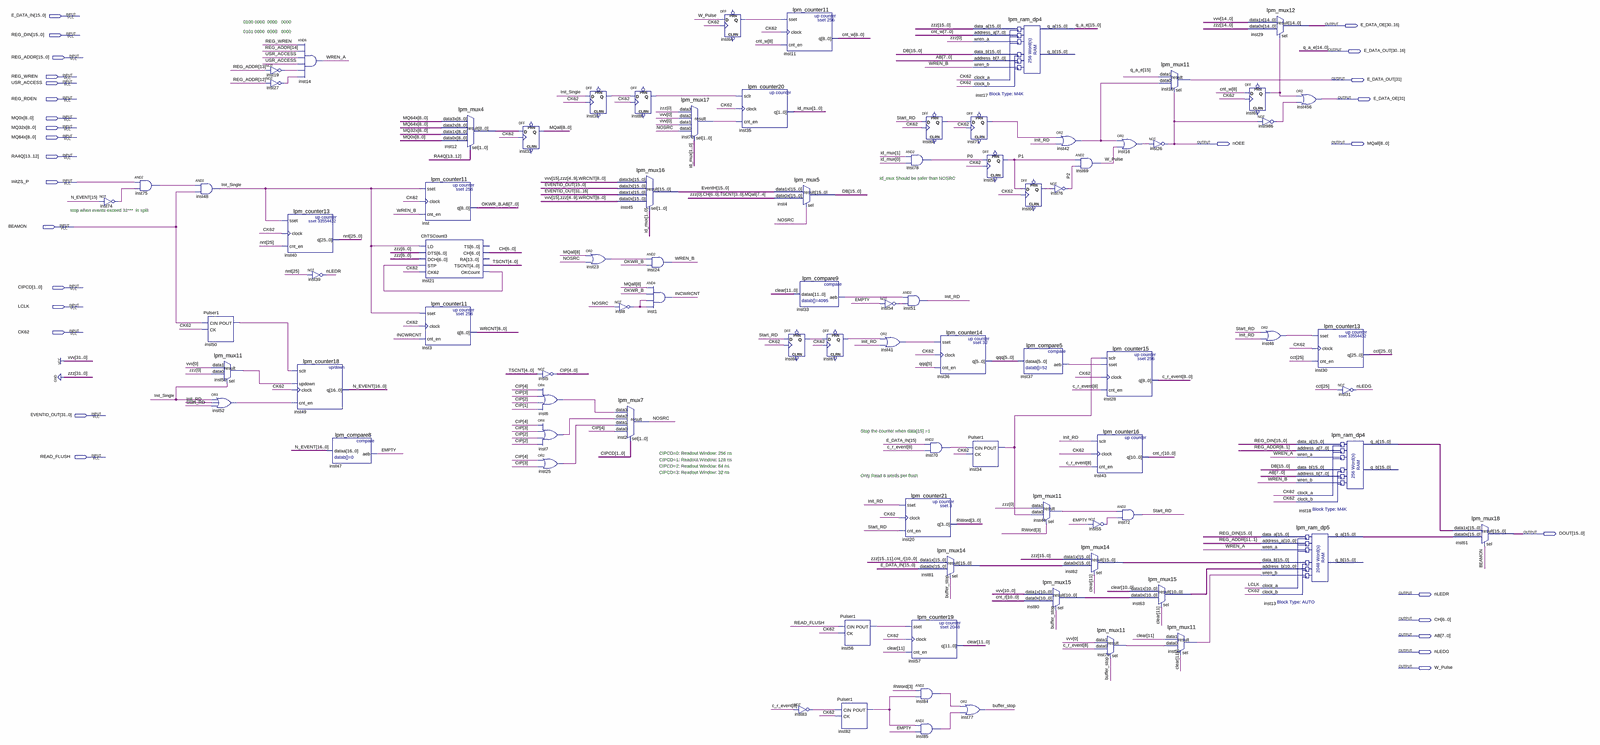
[diagram p0: schematic sheet, whole]
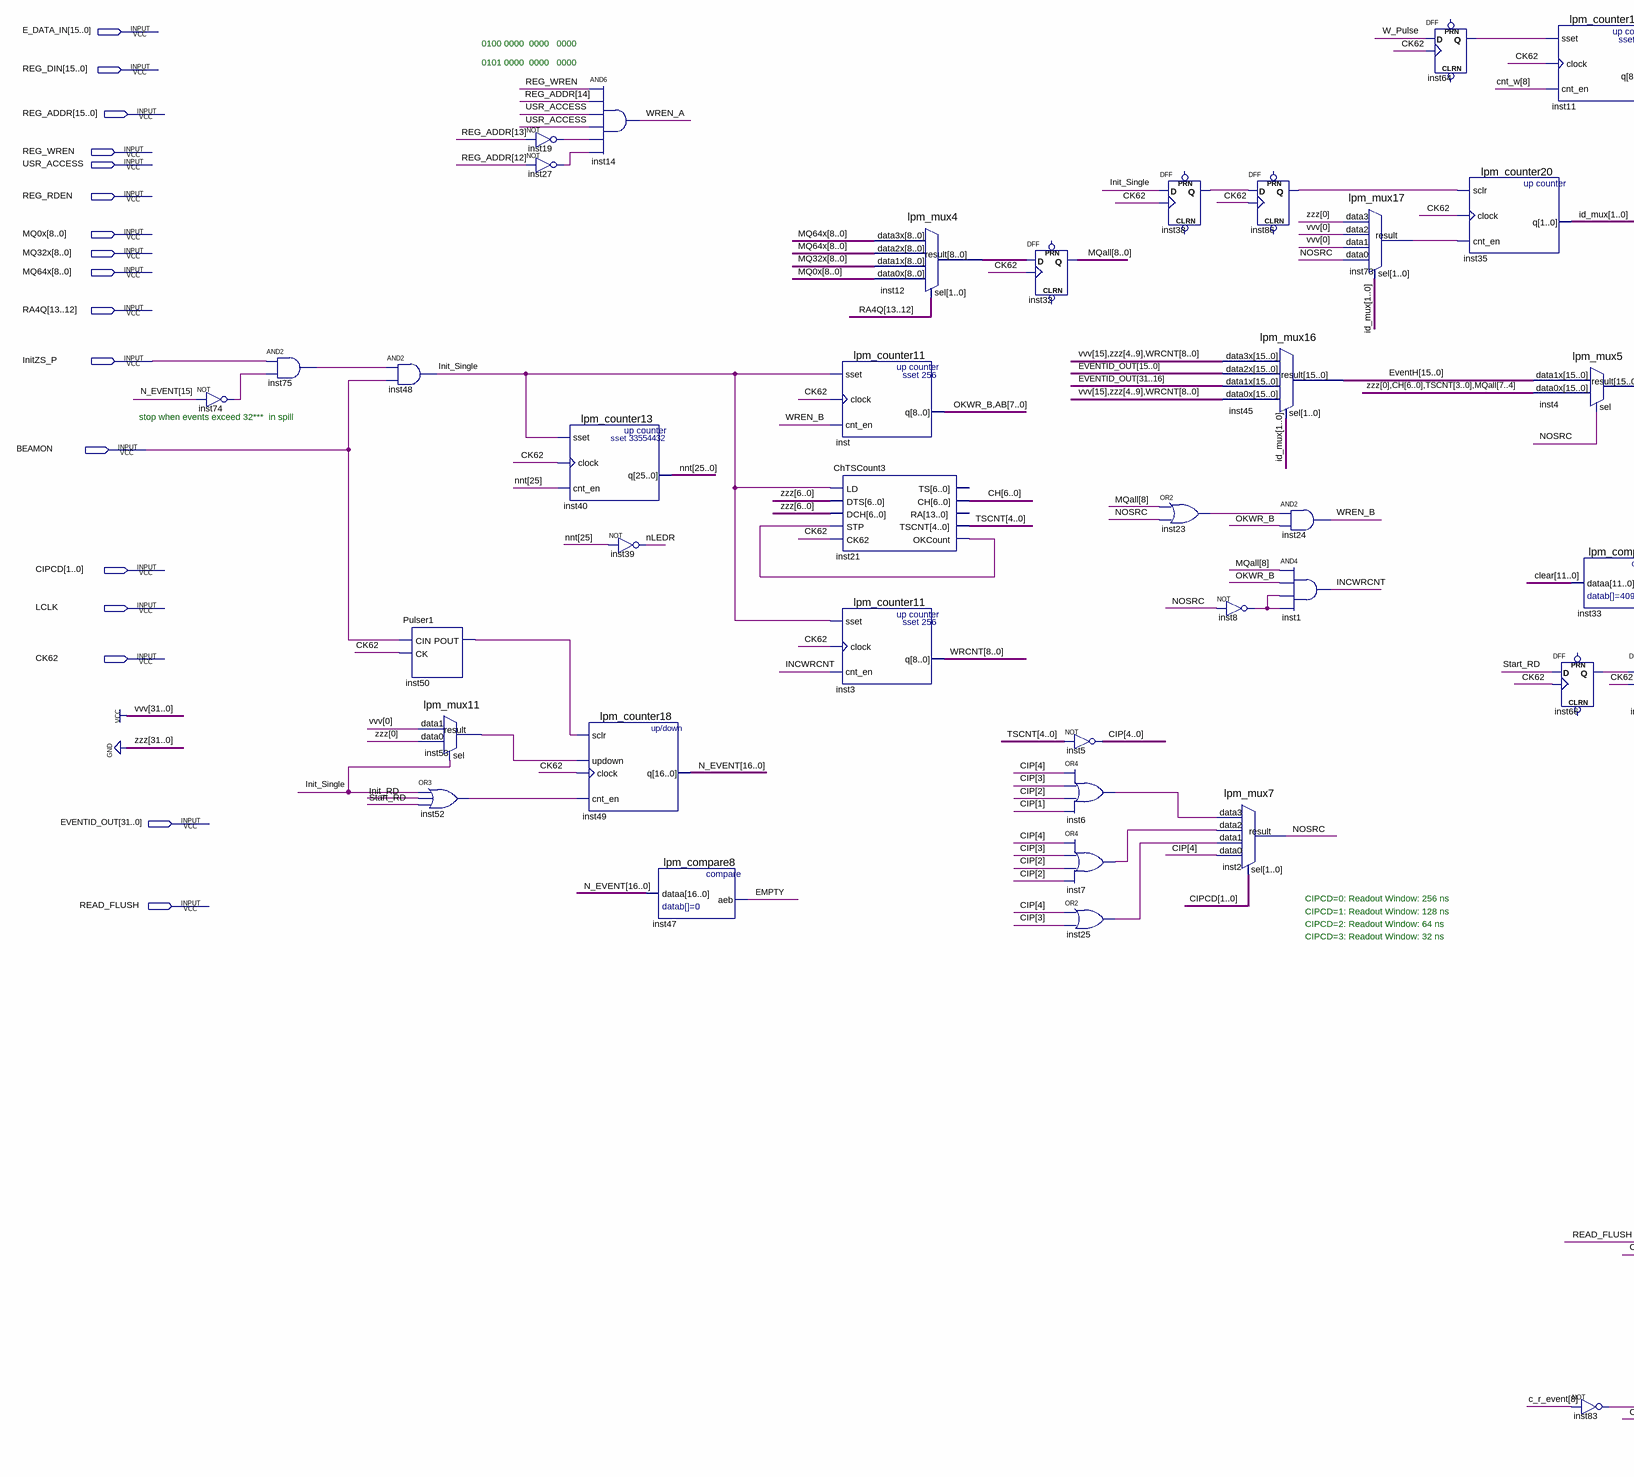
[diagram p1: schematic sheet, left part]
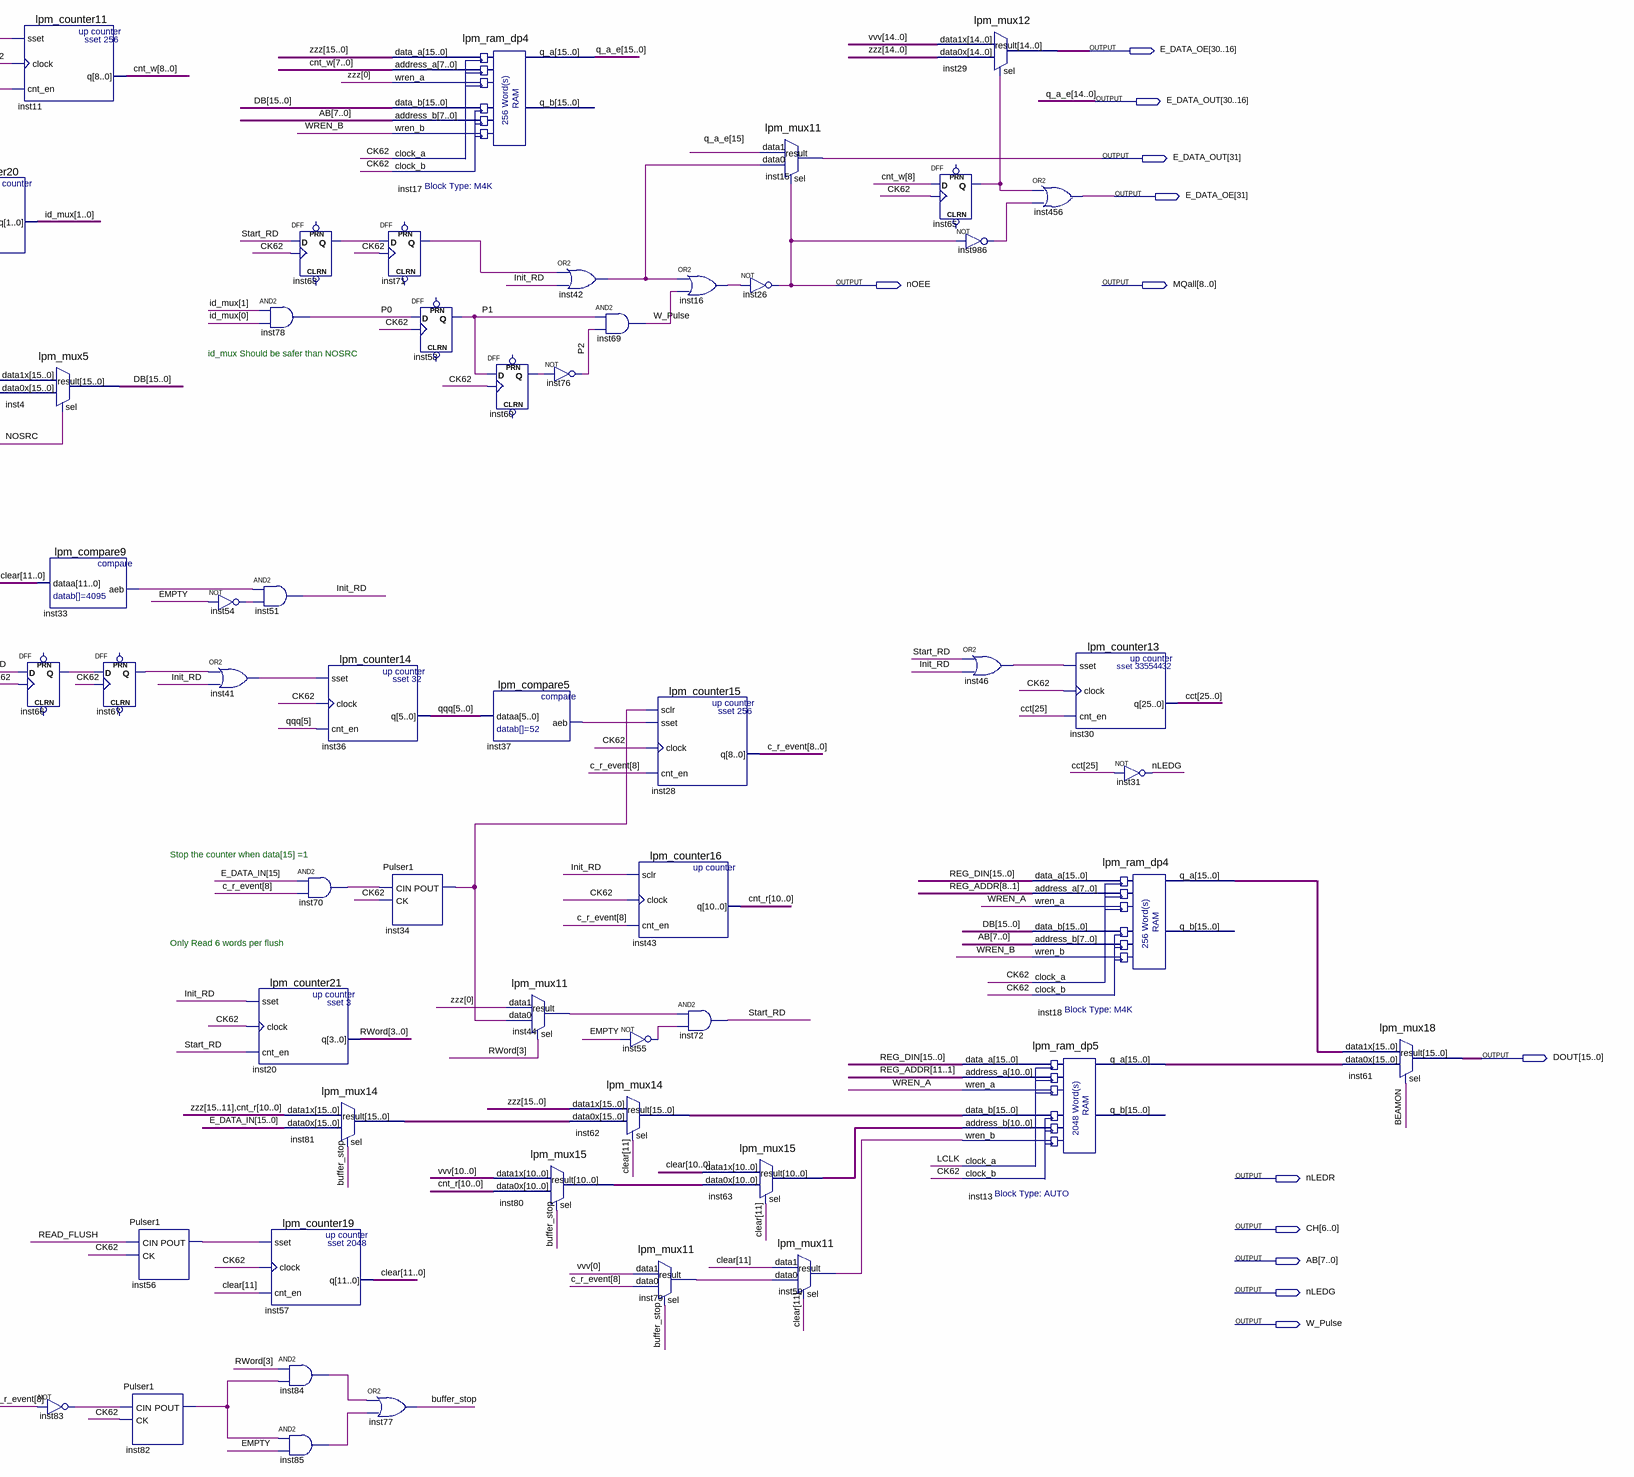
[diagram p2: schematic sheet, right part]
// Quartus schematic ZeroSuppr3.bdf as structural Verilog: 86 symbols, 29 pins
module ZeroSuppr3 (
  input  [15:0] E_DATA_IN,
  input  [15:0] REG_DIN,
  input  [15:0] REG_ADDR,
  input  REG_WREN,
  input  USR_ACCESS,
  input  REG_RDEN,
  input  [8:0] MQ0x,
  input  [8:0] MQ32x,
  input  [8:0] MQ64x,
  input  [13:12] RA4Q,
  input  InitZS_P,
  input  BEAMON,
  input  [1:0] CIPCD,
  input  LCLK,
  input  CK62,
  input  [31:0] EVENTID_OUT,
  input  READ_FLUSH,
  output [31:16] E_DATA_OE,
  output [31:16] E_DATA_OUT,
  output nOEE,
  output [8:0] MQall,
  output [15:0] DOUT,
  output nLEDR,
  output [6:0] CH,
  output [7:0] AB,
  output nLEDG,
  output W_Pulse
);

  wire buffer_stop, EMPTY, INCWRCNT, Init_RD, Init_Single, inst6_out, inst7_out, inst8_out, inst16_out,
       inst19_out, inst21_okcount, inst23_out, inst25_out, inst27_out, inst33_aeb, inst34_pout, inst37_aeb,
       inst38_q, inst41_out, inst42_out, inst44_result, inst46_out, inst50_pout, inst52_out, inst53_result,
       inst54_out, inst55_out, inst56_pout, inst59_result, inst60_q, inst64_q, inst65_q, inst66_q, inst67_q,
       inst68_q, inst70_out, inst71_q, inst73_result, inst74_out, inst75_out, inst79_result, inst82_pout,
       inst83_out, inst84_out, inst85_out, inst86_q, inst986_out, NOSRC, OKWR_B, P0, P1, P2, Start_RD,
       WREN_A, WREN_B;
  wire [1:0] id_mux;
  wire [3:0] RWord;
  wire [4:0] CIP, TSCNT;
  wire [5:0] qqq;
  wire [8:0] c_r_event, cnt_w, inst12_result, WRCNT;
  wire [10:0] cnt_r, inst63_result, inst80_result;
  wire [11:0] clear;
  wire [15:0] DB, EventH, inst13_q_a, inst18_q_a, inst62_result, inst81_result;
  wire [15:15] q_a_e;
  wire [16:0] N_EVENT;
  wire [25:0] cct, nnt;

  not inst74 (inst74_out, N_EVENT[15]);
  and inst75 (inst75_out, InitZS_P, inst74_out);
  and inst48 (Init_Single, inst75_out, BEAMON);
  Pulser1 inst50 (.CIN(BEAMON), .CK(CK62), .POUT(inst50_pout));
  lpm_mux11 inst53 (.data1(1'b1), .data0(1'b0), .sel(Init_Single), .result(inst53_result));
  or inst52 (inst52_out, Init_Single, Init_RD, Start_RD);
  not inst19 (inst19_out, REG_ADDR[13]);
  not inst27 (inst27_out, REG_ADDR[12]);
  lpm_counter13 inst40 (.sset(Init_Single), .clock(CK62), .cnt_en(nnt[25]), .q(nnt));
  and inst14 (WREN_A, REG_WREN, REG_ADDR[14], USR_ACCESS, USR_ACCESS, inst19_out, inst27_out);
  not inst39 (nLEDR, nnt[25]);
  lpm_counter18 inst49 (.sclr(inst50_pout), .updown(inst53_result), .clock(CK62), .cnt_en(inst52_out), .q(N_EVENT));
  lpm_compare8 inst47 (.dataa(N_EVENT), .aeb(EMPTY));
  lpm_counter11 inst (.sset(Init_Single), .clock(CK62), .cnt_en(WREN_B), .q({OKWR_B, AB}));
  ChTSCount3 inst21 (
    .LD(Init_Single), .DTS({7{1'b0}}), .DCH({7{1'b0}}), .STP(inst21_okcount), .CK62(CK62), .CH(CH),
    .TSCNT(TSCNT), .OKCount(inst21_okcount));  // open: TS, RA
  lpm_counter11 inst3 (.sset(Init_Single), .clock(CK62), .cnt_en(INCWRCNT), .q(WRCNT));
  lpm_mux4 inst12 (.data3x(MQ64x), .data2x(MQ64x), .data1x(MQ32x), .data0x(MQ0x), .sel(RA4Q), .result(inst12_result));
  DFF inst32[8:0] (.CLK(CK62), .D(inst12_result), .Q(MQall));  // open: CLRN, PRN
  assign CIP = ~TSCNT;  // NOT inst5, 5 bits wide
  or inst6 (inst6_out, CIP[4], CIP[3], CIP[2], CIP[1]);
  or inst7 (inst7_out, CIP[4], CIP[3], CIP[2], CIP[2]);
  or inst25 (inst25_out, CIP[4], CIP[3]);
  DFF inst38 (.CLK(CK62), .D(Init_Single), .Q(inst38_q));  // open: CLRN, PRN
  or inst23 (inst23_out, MQall[8], NOSRC);
  lpm_mux16 inst45 (
    .data3x({7'b1000000, WRCNT}), .data2x(EVENTID_OUT[15:0]), .data1x(EVENTID_OUT[31:16]),
    .data0x({7'b1000000, WRCNT}), .sel(id_mux), .result(EventH));
  not inst8 (inst8_out, NOSRC);
  lpm_mux7 inst2 (
    .data3(inst6_out), .data2(inst7_out), .data1(inst25_out), .data0(CIP[4]), .sel(CIPCD), .result(NOSRC));
  DFF inst86 (.CLK(CK62), .D(inst38_q), .Q(inst86_q));  // open: CLRN, PRN
  and inst24 (WREN_B, inst23_out, OKWR_B);
  and inst1 (INCWRCNT, MQall[8], OKWR_B, inst8_out, inst8_out);
  lpm_mux17 inst73 (.data3(1'b0), .data2(1'b1), .data1(1'b1), .data0(NOSRC), .sel(id_mux), .result(inst73_result));
  DFF inst64 (.CLK(CK62), .D(W_Pulse), .Q(inst64_q));  // open: CLRN, PRN
  lpm_counter20 inst35 (.sclr(inst86_q), .clock(CK62), .cnt_en(inst73_result), .q(id_mux));
  lpm_counter11 inst11 (.sset(inst64_q), .clock(CK62), .cnt_en(cnt_w[8]), .q(cnt_w));
  lpm_mux5 inst4 (.data1x(EventH), .data0x({1'b0, CH, TSCNT[3:0], MQall[7:4]}), .sel(NOSRC), .result(DB));
  lpm_compare9 inst33 (.dataa(clear), .aeb(inst33_aeb));
  DFF inst66 (.CLK(CK62), .D(Start_RD), .Q(inst66_q));  // open: CLRN, PRN
  not inst83 (inst83_out, c_r_event[8]);
  DFF inst67 (.CLK(CK62), .D(inst66_q), .Q(inst67_q));  // open: CLRN, PRN
  Pulser1 inst56 (.CIN(READ_FLUSH), .CK(CK62), .POUT(inst56_pout));
  Pulser1 inst82 (.CIN(inst83_out), .CK(CK62), .POUT(inst82_pout));
  not inst54 (inst54_out, EMPTY);
  or inst41 (inst41_out, inst67_q, Init_RD);
  lpm_counter21 inst20 (.sset(Init_RD), .clock(CK62), .cnt_en(Start_RD), .q(RWord));
  DFF inst68 (.CLK(CK62), .D(Start_RD), .Q(inst68_q));  // open: CLRN, PRN
  and inst78 (P0, id_mux[1], id_mux[0]);
  and inst51 (Init_RD, inst33_aeb, inst54_out);
  and inst70 (inst70_out, E_DATA_IN[15], c_r_event[8]);
  lpm_mux14 inst81 (.data1x({{5{1'b0}}, cnt_r}), .data0x(E_DATA_IN), .sel(buffer_stop), .result(inst81_result));
  lpm_counter19 inst57 (.sset(inst56_pout), .clock(CK62), .cnt_en(clear[11]), .q(clear));
  and inst84 (inst84_out, RWord[3], inst82_pout);
  and inst85 (inst85_out, inst82_pout, EMPTY);
  lpm_counter14 inst36 (.sset(inst41_out), .clock(CK62), .cnt_en(qqq[5]), .q(qqq));
  lpm_ram_dp4 inst17 (
    .data_a({16{1'b0}}), .address_a(cnt_w[7:0]), .wren_a(1'b0), .data_b(DB), .address_b(AB), .wren_b(WREN_B),
    .clock_a(CK62), .clock_b(CK62), .q_a({q_a_e[15], E_DATA_OUT[30:16]}));  // open: q_b
  DFF inst71 (.CLK(CK62), .D(inst68_q), .Q(inst71_q));  // open: CLRN, PRN
  Pulser1 inst34 (.CIN(inst70_out), .CK(CK62), .POUT(inst34_pout));
  or inst77 (buffer_stop, inst84_out, inst85_out);
  DFF inst58 (.CLK(CK62), .D(P0), .Q(P1));  // open: CLRN, PRN
  DFF inst60 (.CLK(CK62), .D(P1), .Q(inst60_q));  // open: CLRN, PRN
  lpm_compare5 inst37 (.dataa(qqq), .aeb(inst37_aeb));
  lpm_mux15 inst80 (.data1x({11{1'b1}}), .data0x(cnt_r), .sel(buffer_stop), .result(inst80_result));
  not inst76 (P2, inst60_q);
  lpm_mux11 inst44 (.data1(1'b0), .data0(inst34_pout), .sel(RWord[3]), .result(inst44_result));
  or inst42 (inst42_out, inst71_q, Init_RD);
  and inst69 (W_Pulse, P1, P2);
  lpm_mux14 inst62 (.data1x({16{1'b0}}), .data0x(inst81_result), .sel(clear[11]), .result(inst62_result));
  lpm_counter15 inst28 (.sclr(inst34_pout), .sset(inst37_aeb), .clock(CK62), .cnt_en(c_r_event[8]), .q(c_r_event));
  lpm_counter16 inst43 (.sclr(Init_RD), .clock(CK62), .cnt_en(c_r_event[8]), .q(cnt_r));
  not inst55 (inst55_out, EMPTY);
  lpm_mux11 inst79 (.data1(1'b1), .data0(c_r_event[8]), .sel(buffer_stop), .result(inst79_result));
  or inst16 (inst16_out, inst42_out, W_Pulse);
  and inst72 (Start_RD, inst44_result, inst55_out);
  lpm_mux15 inst63 (.data1x(clear[10:0]), .data0x(inst80_result), .sel(clear[11]), .result(inst63_result));
  not inst26 (nOEE, inst16_out);
  lpm_mux11 inst15 (.data1(q_a_e[15]), .data0(inst42_out), .sel(nOEE), .result(E_DATA_OUT[31]));
  lpm_mux11 inst59 (.data1(clear[11]), .data0(inst79_result), .sel(clear[11]), .result(inst59_result));
  lpm_mux12 inst29 (.data1x({15{1'b1}}), .data0x({15{1'b0}}), .sel(inst65_q), .result(E_DATA_OE[30:16]));
  DFF inst65 (.CLK(CK62), .D(cnt_w[8]), .Q(inst65_q));  // open: CLRN, PRN
  not inst986 (inst986_out, nOEE);
  or inst46 (inst46_out, Start_RD, Init_RD);
  lpm_ram_dp5 inst13 (
    .data_a(REG_DIN), .address_a(REG_ADDR[11:1]), .wren_a(WREN_A), .data_b(inst62_result),
    .address_b(inst63_result), .wren_b(inst59_result), .clock_a(LCLK), .clock_b(CK62), .q_a(inst13_q_a));  // open: q_b
  or inst456 (E_DATA_OE[31], inst65_q, inst986_out);
  lpm_ram_dp4 inst18 (
    .data_a(REG_DIN), .address_a(REG_ADDR[8:1]), .wren_a(WREN_A), .data_b(DB), .address_b(AB),
    .wren_b(WREN_B), .clock_a(CK62), .clock_b(CK62), .q_a(inst18_q_a));  // open: q_b
  lpm_counter13 inst30 (.sset(inst46_out), .clock(CK62), .cnt_en(cct[25]), .q(cct));
  not inst31 (nLEDG, cct[25]);
  lpm_mux18 inst61 (.data1x(inst18_q_a), .data0x(inst13_q_a), .sel(BEAMON), .result(DOUT));

  // Other names for the same wires on the sheet: q_a_e[14:0] = E_DATA_OUT[30:16]

  // Notes on the sheet:
  //   0100 0000  0000   0000
  //   0101 0000  0000   0000
  //   id_mux Should be safer than NOSRC
  //   stop when events exceed 32***  in spill
  //   Stop the counter when data[15] =1
  //   CIPCD=0: Readout Window: 256 ns
  //   CIPCD=1: Readout Window: 128 ns
  //   CIPCD=2: Readout Window: 64 ns
  //   CIPCD=3: Readout Window: 32 ns
  //   Only Read 6 words per flush
endmodule
